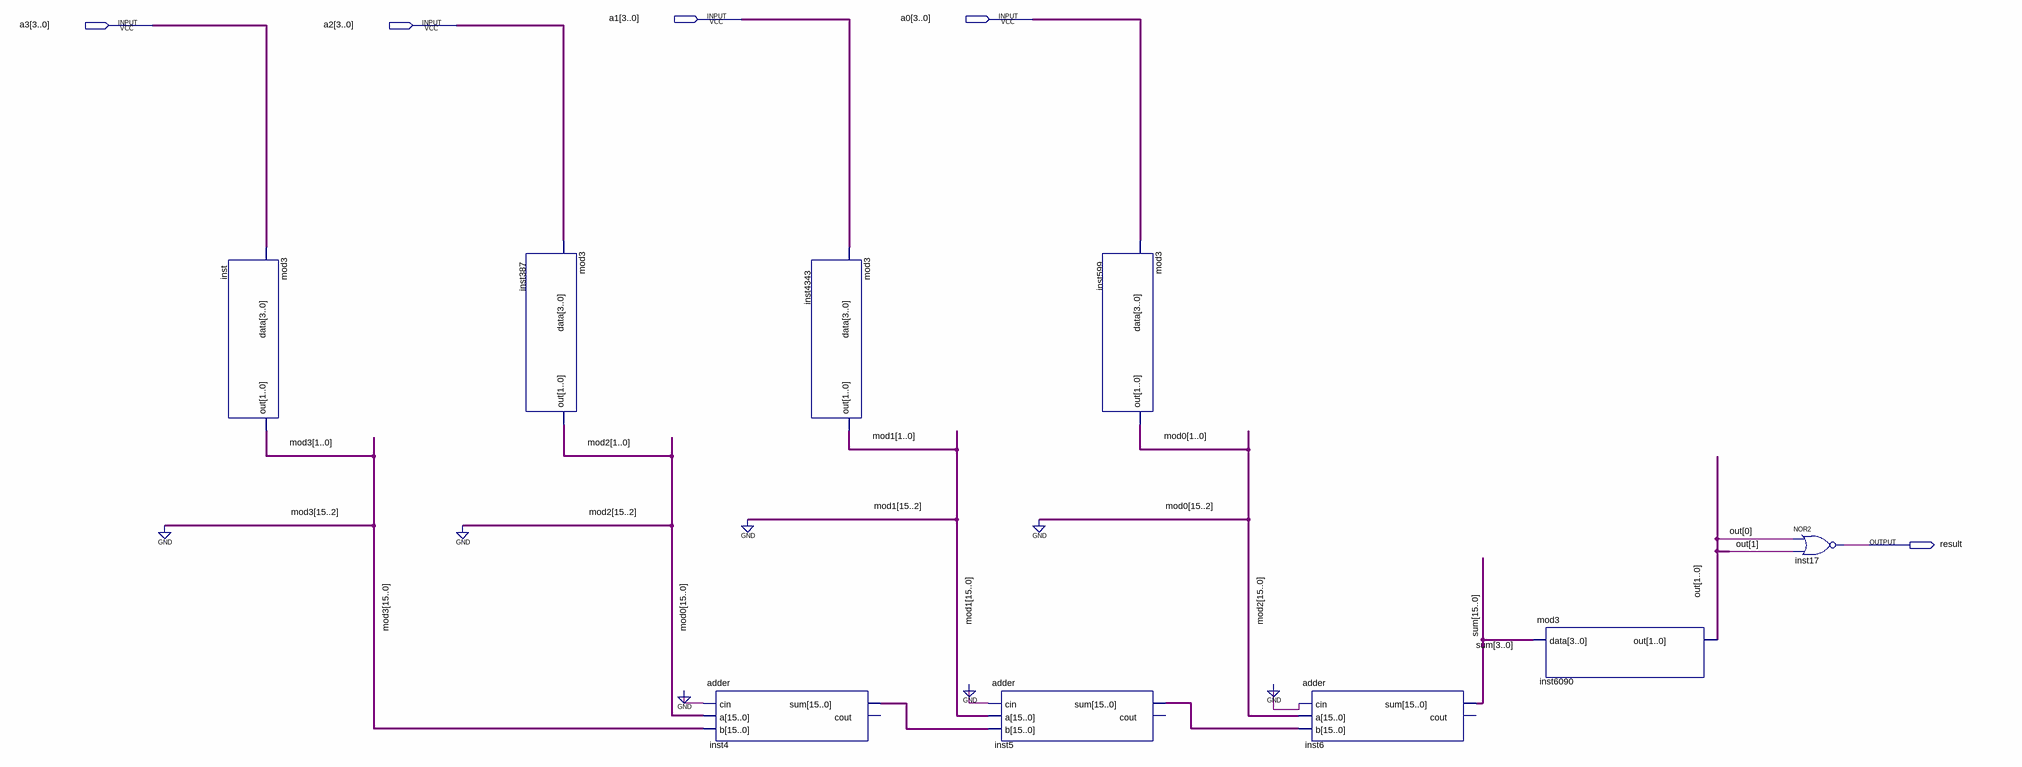
[diagram p0: schematic sheet]
// Quartus schematic div3.bdf as structural Verilog: 9 symbols, 5 pins
module div3 (
  input  [3:0] a1,
  input  [3:0] a0,
  input  [3:0] a3,
  input  [3:0] a2,
  output result
);

  wire [1:0] mod0, mod1, mod2, mod3, out;
  wire [15:0] inst4_sum, inst5_sum, sum;

  mod3 inst (.data(a3), .out(mod3));
  mod3 inst387 (.data(a2), .out(mod2));
  adder inst4 (.cin(1'b0), .a({{14{1'b0}}, mod0}), .b({{14{1'b0}}, mod3}), .sum(inst4_sum));  // open: cout
  mod3 inst4343 (.data(a1), .out(mod1));
  adder inst5 (.cin(1'b0), .a({{14{1'b0}}, mod1}), .b(inst4_sum), .sum(inst5_sum));  // open: cout
  mod3 inst599 (.data(a0), .out(mod0));
  adder inst6 (.cin(1'b0), .a({{14{1'b0}}, mod2}), .b(inst5_sum), .sum(sum));  // open: cout
  mod3 inst6090 (.data(sum[3:0]), .out(out));
  nor inst17 (result, out[0], out[1]);
endmodule
